# Altium schematic sheet Channel_B.SchDoc
size OrCAD E; SheetNumber: 6; SheetTotal: 6
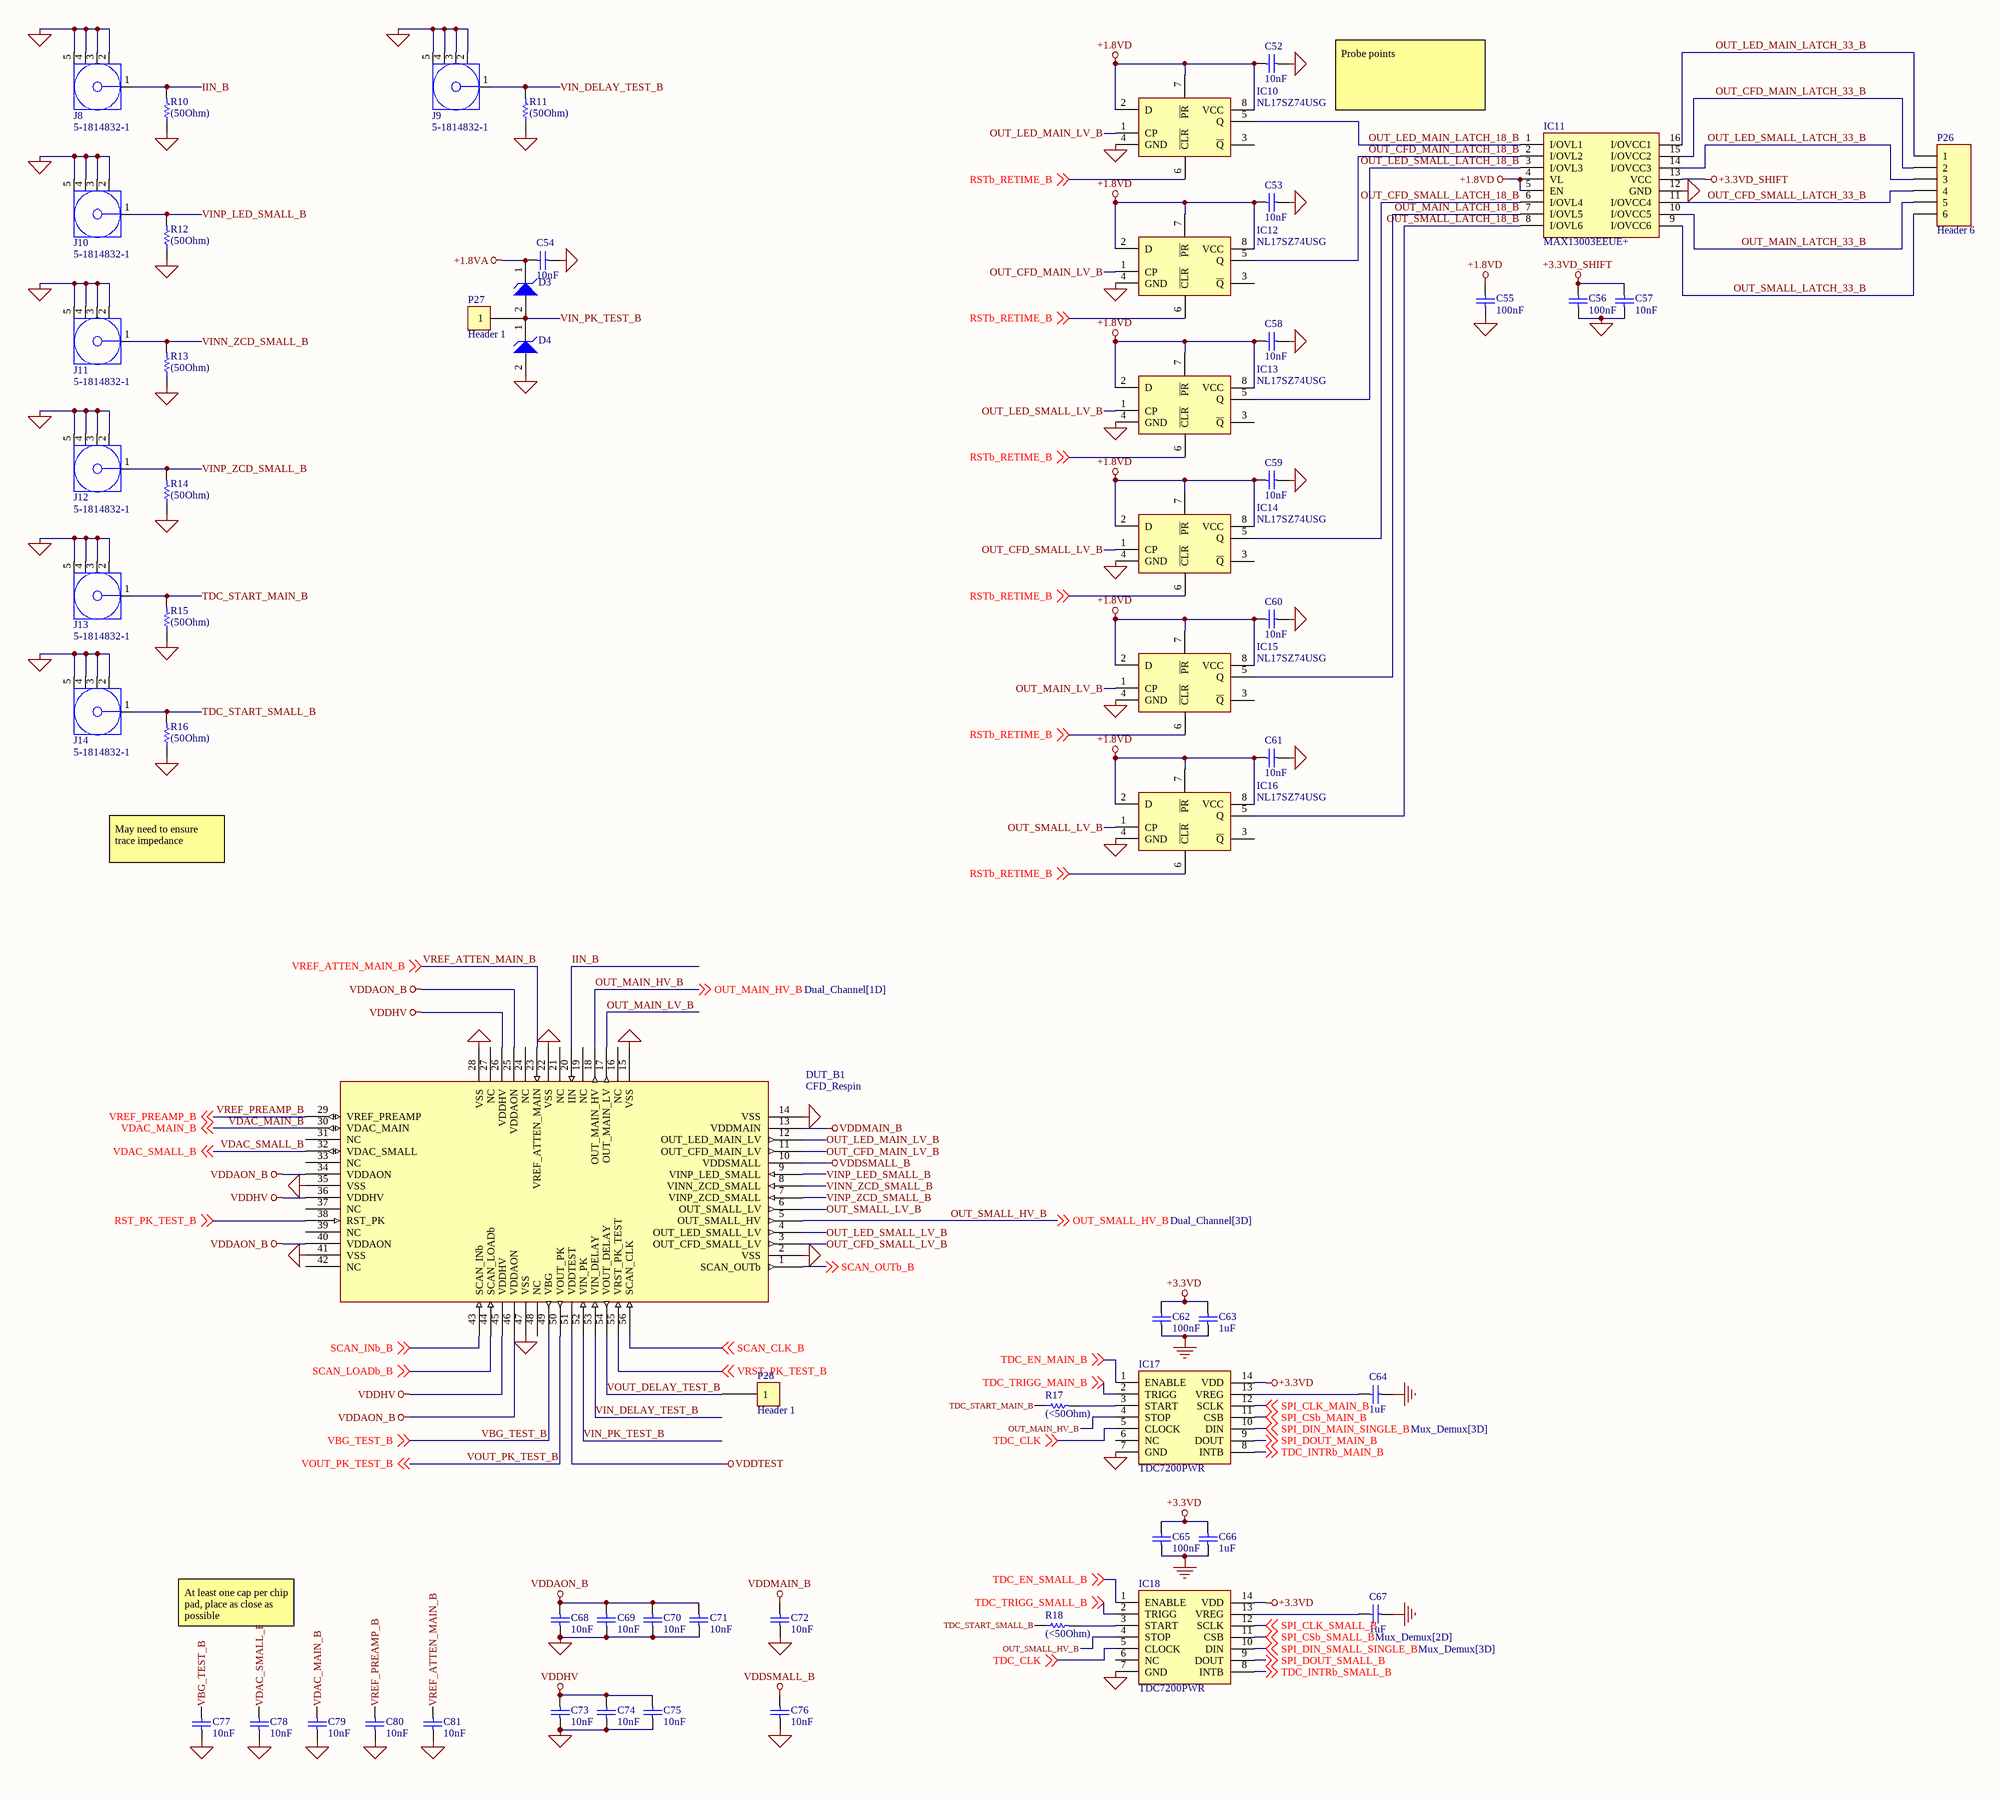
[diagram p0: Channel_B.SchDoc]

## Parts
C52  10nF  [CAPC1608X90X35ML10T15]
C53  10nF  [CAPC1608X90X35ML10T15]
C54  10nF  [CAPC1608X90X35ML10T15]
C55  100nF  [CAPC1608X90X35ML10T15]
C56  100nF  [CAPC1608X90X35ML10T15]
C57  10nF  [CAPC1608X90X35ML10T15]
C58  10nF  [CAPC1608X90X35ML10T15]
C59  10nF  [CAPC1608X90X35ML10T15]
C60  10nF  [CAPC1608X90X35ML10T15]
C61  10nF  [CAPC1608X90X35ML10T15]
C62  100nF  [CAPC1608X90X35ML10T15]
C63  1uF  [CAPC1608X90X35ML10T15]
C64  1uF  [CAPC1608X90X35ML10T15]
C65  100nF  [CAPC1608X90X35ML10T15]
C66  1uF  [CAPC1608X90X35ML10T15]
C67  1uF  [CAPC1608X90X35ML10T15]
C68  10nF  [CAPC1608X90X35ML10T15]
C69  10nF  [CAPC1608X90X35ML10T15]
C70  10nF  [CAPC1608X90X35ML10T15]
C71  10nF  [CAPC1608X90X35ML10T15]
C72  10nF  [CAPC1608X90X35ML10T15]
C73  10nF  [CAPC1608X90X35ML10T15]
C74  10nF  [CAPC1608X90X35ML10T15]
C75  10nF  [CAPC1608X90X35ML10T15]
C76  10nF  [CAPC1608X90X35ML10T15]
C77  10nF  [CAPC1608X90X35ML10T15]
C78  10nF  [CAPC1608X90X35ML10T15]
C79  10nF  [CAPC1608X90X35ML10T15]
C80  10nF  [CAPC1608X90X35ML10T15]
C81  10nF  [CAPC1608X90X35ML10T15]
D3  (no value)  [ONSC-SOD-123-2-425-04_V]
D4  (no value)  [ONSC-SOD-123-2-425-04_V]
DUT_B1  CFD_Respin  [QFN50P800X800X80_HS-57N_WIDEVIAS]
IC10  NL17SZ74USG  [SOP50P310X90-8N]
IC11  MAX13003EEUE+  [SOP65P640X110-16N]
IC12  NL17SZ74USG  [SOP50P310X90-8N]
IC13  NL17SZ74USG  [SOP50P310X90-8N]
IC14  NL17SZ74USG  [SOP50P310X90-8N]
IC15  NL17SZ74USG  [SOP50P310X90-8N]
IC16  NL17SZ74USG  [SOP50P310X90-8N]
IC17  TDC7200PWR  [SOP65P640X120-14N]
IC18  TDC7200PWR  [SOP65P640X120-14N]
J8  5-1814832-1  [TECO-5-1814832-1_V]
J9  5-1814832-1  [TECO-5-1814832-1_V]
J10  5-1814832-1  [TECO-5-1814832-1_V]
J11  5-1814832-1  [TECO-5-1814832-1_V]
J12  5-1814832-1  [TECO-5-1814832-1_V]
J13  5-1814832-1  [TECO-5-1814832-1_V]
J14  5-1814832-1  [TECO-5-1814832-1_V]
P26  Header 6  [HDR1X6]
P27  Header 1  [Header1]
P28  Header 1  [Header1]
R10  (50Ohm)  [RESC1609X50X30NL8T20]
R11  (50Ohm)  [RESC1609X50X30NL8T20]
R12  (50Ohm)  [RESC1609X50X30NL8T20]
R13  (50Ohm)  [RESC1609X50X30NL8T20]
R14  (50Ohm)  [RESC1609X50X30NL8T20]
R15  (50Ohm)  [RESC1609X50X30NL8T20]
R16  (50Ohm)  [RESC1609X50X30NL8T20]
R17  (<50Ohm)  [RESC1609X50X30NL8T20]
R18  (<50Ohm)  [RESC1609X50X30NL8T20]

## Nets
+1.8VA: C54.2 D3.1(K)
+1.8VD: C52.2 C53.2 C55.2 C58.2 C59.2 C60.2 C61.2 IC10.2(D) IC10.7(~{PR}) IC10.8(VCC) IC11.4(VL) IC11.5(EN) IC12.2(D) IC12.7(~{PR}) IC12.8(VCC) IC13.2(D) IC13.7(~{PR}) IC13.8(VCC) IC14.2(D) IC14.7(~{PR}) IC14.8(VCC) IC15.2(D) IC15.7(~{PR}) IC15.8(VCC) IC16.2(D) IC16.7(~{PR}) IC16.8(VCC)
+3.3VD: C62.1 C63.1 C65.1 C66.1 IC17.14(VDD) IC18.14(VDD)
+3.3VD_SHIFT: C56.2 C57.2 IC11.13(VCC)
GND: C52.1 C53.1 C54.1 C55.1 C56.1 C57.1 C58.1 C59.1 C60.1 C61.1 C62.2 C63.2 C64.2 C65.2 C66.2 C67.2 C68.1 C69.1 C70.1 C71.1 C72.1 C73.1 C74.1 C75.1 C76.1 C77.1 C78.1 C79.1 C80.1 C81.1 D4.2(A) DUT_B1.2(VSS) DUT_B1.14(VSS) DUT_B1.15(VSS) DUT_B1.22(VSS) DUT_B1.28(VSS) DUT_B1.35(VSS) DUT_B1.41(VSS) DUT_B1.47(VSS) IC10.4(GND) IC11.12(GND) IC12.4(GND) IC13.4(GND) IC14.4(GND) IC15.4(GND) IC16.4(GND) IC17.7(GND) IC18.7(GND) J8.2 J8.3 J8.4 J8.5 J9.2 J9.3 J9.4 J9.5 J10.2 J10.3 J10.4 J10.5 J11.2 J11.3 J11.4 J11.5 J12.2 J12.3 J12.4 J12.5 J13.2 J13.3 J13.4 J13.5 J14.2 J14.3 J14.4 J14.5 R10.1 R11.1 R12.1 R13.1 R14.1 R15.1 R16.1
VDDAON_B: C68.2 C69.2 C70.2 C71.2 DUT_B1.25(VDDAON) DUT_B1.34(VDDAON) DUT_B1.40(VDDAON) DUT_B1.46(VDDAON)
VDDHV: C73.2 C74.2 C75.2 DUT_B1.26(VDDHV) DUT_B1.36(VDDHV) DUT_B1.45(VDDHV)
VDDMAIN_B: C72.2 DUT_B1.13(VDDMAIN)
VDDSMALL_B: C76.2 DUT_B1.10(VDDSMALL)
VDDTEST: DUT_B1.51(VDDTEST)
IIN_B: DUT_B1.20(IIN) J8.1 R10.2
OUT_CFD_MAIN_LATCH_18_B: IC11.2(I/OVL2) IC12.5(Q)
OUT_CFD_MAIN_LATCH_33_B: IC11.15(I/OVCC2) P26.2
OUT_CFD_MAIN_LV_B: DUT_B1.11(OUT_CFD_MAIN_LV) IC12.1(CP)
OUT_CFD_SMALL_LATCH_18_B: IC11.6(I/OVL4) IC14.5(Q)
OUT_CFD_SMALL_LATCH_33_B: IC11.11(I/OVCC4) P26.4
OUT_CFD_SMALL_LV_B: DUT_B1.3(OUT_CFD_SMALL_LV) IC14.1(CP)
OUT_LED_MAIN_LATCH_18_B: IC10.5(Q) IC11.1(I/OVL1)
OUT_LED_MAIN_LATCH_33_B: IC11.16(I/OVCC1) P26.1
OUT_LED_MAIN_LV_B: DUT_B1.12(OUT_LED_MAIN_LV) IC10.1(CP)
OUT_LED_SMALL_LATCH_18_B: IC11.3(I/OVL3) IC13.5(Q)
OUT_LED_SMALL_LATCH_33_B: IC11.14(I/OVCC3) P26.3
OUT_LED_SMALL_LV_B: DUT_B1.4(OUT_LED_SMALL_LV) IC13.1(CP)
OUT_MAIN_HV_B: DUT_B1.18(OUT_MAIN_HV) IC17.4(STOP) ; off-sheet OUT_MAIN_HV_B
OUT_MAIN_LATCH_18_B: IC11.7(I/OVL5) IC15.5(Q)
OUT_MAIN_LATCH_33_B: IC11.10(I/OVCC5) P26.5
OUT_MAIN_LV_B: DUT_B1.17(OUT_MAIN_LV) IC15.1(CP)
OUT_SMALL_HV_B: DUT_B1.5(OUT_SMALL_HV) IC18.4(STOP) ; off-sheet OUT_SMALL_HV_B
OUT_SMALL_LATCH_18_B: IC11.8(I/OVL6) IC16.5(Q)
OUT_SMALL_LATCH_33_B: IC11.9(I/OVCC6) P26.6
OUT_SMALL_LV_B: DUT_B1.6(OUT_SMALL_LV) IC16.1(CP)
RST_PK_TEST_B: DUT_B1.38(RST_PK) ; off-sheet RST_PK_TEST_B
RSTb_RETIME_B: IC10.6(~{CLR}) IC12.6(~{CLR}) IC13.6(~{CLR}) IC14.6(~{CLR}) IC15.6(~{CLR}) IC16.6(~{CLR}) ; off-sheet RSTb_RETIME_B
SCAN_CLK_B: DUT_B1.56(SCAN_CLK) ; off-sheet SCAN_CLK_B
SCAN_INb_B: DUT_B1.43(SCAN_INb) ; off-sheet SCAN_INb_B
SCAN_LOADb_B: DUT_B1.44(SCAN_LOADb) ; off-sheet SCAN_LOADb_B
SCAN_OUTb_B: DUT_B1.1(SCAN_OUTb) ; off-sheet SCAN_OUTb_B
SPI_CLK_MAIN_B: IC17.12(SCLK) ; off-sheet SPI_CLK_MAIN_B
SPI_CLK_SMALL_B: IC18.12(SCLK) ; off-sheet SPI_CLK_SMALL_B
SPI_CSb_MAIN_B: IC17.11(CSB) ; off-sheet SPI_CSb_MAIN_B
SPI_CSb_SMALL_B: IC18.11(CSB) ; off-sheet SPI_CSb_SMALL_B
SPI_DIN_MAIN_SINGLE_B: IC17.10(DIN) ; off-sheet SPI_DIN_MAIN_SINGLE_B
SPI_DIN_SMALL_SINGLE_B: IC18.10(DIN) ; off-sheet SPI_DIN_SMALL_SINGLE_B
SPI_DOUT_MAIN_B: IC17.9(DOUT) ; off-sheet SPI_DOUT_MAIN_B
SPI_DOUT_SMALL_B: IC18.9(DOUT) ; off-sheet SPI_DOUT_SMALL_B
TDC_CLK: IC17.5(CLOCK) IC18.5(CLOCK) ; off-sheet TDC_CLK
TDC_EN_MAIN_B: IC17.1(ENABLE) ; off-sheet TDC_EN_MAIN_B
TDC_EN_SMALL_B: IC18.1(ENABLE) ; off-sheet TDC_EN_SMALL_B
TDC_INTRb_MAIN_B: IC17.8(INTB) ; off-sheet TDC_INTRb_MAIN_B
TDC_INTRb_SMALL_B: IC18.8(INTB) ; off-sheet TDC_INTRb_SMALL_B
TDC_START_MAIN_B: J13.1 R15.2 R17.1
TDC_START_SMALL_B: J14.1 R16.2 R18.1
TDC_TRIGG_MAIN_B: IC17.2(TRIGG) ; off-sheet TDC_TRIGG_MAIN_B
TDC_TRIGG_SMALL_B: IC18.2(TRIGG) ; off-sheet TDC_TRIGG_SMALL_B
VBG_TEST_B: C77.2 DUT_B1.49(VBG) ; off-sheet VBG_TEST_B
VDAC_MAIN_B: C79.2 DUT_B1.30(VDAC_MAIN) ; off-sheet VDAC_MAIN_B
VDAC_SMALL_B: C78.2 DUT_B1.32(VDAC_SMALL) ; off-sheet VDAC_SMALL_B
VIN_DELAY_TEST_B: DUT_B1.53(VIN_DELAY) J9.1 R11.2
VIN_PK_TEST_B: D3.2(A) D4.1(K) DUT_B1.52(VIN_PK) P27.1
VINN_ZCD_SMALL_B: DUT_B1.8(VINN_ZCD_SMALL) J11.1 R13.2
VINP_LED_SMALL_B: DUT_B1.9(VINP_LED_SMALL) J10.1 R12.2
VINP_ZCD_SMALL_B: DUT_B1.7(VINP_ZCD_SMALL) J12.1 R14.2
VOUT_DELAY_TEST_B: DUT_B1.54(VOUT_DELAY) P28.1
VOUT_PK_TEST_B: DUT_B1.50(VOUT_PK) ; off-sheet VOUT_PK_TEST_B
VREF_ATTEN_MAIN_B: C81.2 DUT_B1.23(VREF_ATTEN_MAIN) ; off-sheet VREF_ATTEN_MAIN_B
VREF_PREAMP_B: C80.2 DUT_B1.29(VREF_PREAMP) ; off-sheet VREF_PREAMP_B
VRST_PK_TEST_B: DUT_B1.55(VRST_PK_TEST) ; off-sheet VRST_PK_TEST_B
NetC64_1: C64.1 IC17.13(VREG)
NetC67_1: C67.1 IC18.13(VREG)
NetIC17_3: IC17.3(START) R17.2
NetIC18_3: IC18.3(START) R18.2

Not connected (* = marked no-connect by the designer): DUT_B1 16(NC) 19(NC) 21(NC) 24(NC) 27(NC) 31(NC) 33(NC) 37(NC) 39(NC) 42(NC) 48(NC); IC10 3(~{Q}); IC12 3(~{Q}); IC13 3(~{Q}); IC14 3(~{Q}); IC15 3(~{Q}); IC16 3(~{Q}); IC17 6(NC); IC18 6(NC)

## Notes on the sheet
- Probe points
- May need to ensure trace impedance
- At least one cap per chip pad, place as close as possible

## Library data of the parts
C52-C81 = CMP-2000-04945-1: 0603; Manufacturer: Murata; Capacitance: 22pF; Tolerance (%): ±5%; Rated Voltage: 50V; Dielectric: C0G; Manufacturer URL: http://www.murata.com/; Datasheet Version: Jul-06; Package Reference: 603; Case Size/Dimension: 0603; Package Description: 2-Pin Surface Mount Device, Body 1.6 x 0.8 mm; Datasheet URL: https://datasheet.ciiva.com/11786/0900766b807a1cab-11786398.pdf
D3 D4 = CMP-1060-00509-1: Zener Voltage Regulator, 2-Pin SOD-123, Pb-Free, Tape and Reel; Manufacturer: On Semiconductor; PartNumber: MMSZ4679T1G; P Max (W): 0.5; VZ Typ (V): 2; Packing: Tape and Reel; ComponentLink1Description: Manufacturer URL; DatasheetVersion: Rev. 9; PackageReference: SOD-123-2-425-04; ComponentLink3URL: http://www.onsemi.com/pub_link/Collateral/425-04.PDF; PackageDescription: 2-Pin SOD, Body 1.6 x 2.69 mm; ComponentLink3Description: Package Specification; ComponentLink2Description: Datasheet; ComponentLink1URL: http://www.onsemi.com/; RoHS: Pb-Free; PackageVersion: Rev. G, 10/2009; ComponentLink2URL: http://www.onsemi.com/pub_link/Collateral/MMSZ4678T1-D.PDF; Mounting Technology: Surface Mount
IC10 IC12-IC16 = NL17SZ74USG: Flip Flops 1.65-5.5V CMOS Single D-Type; Manufacturer_Name: ON Semiconductor; Datasheet Link: http://www.onsemi.com/pub/Collateral/NL17SZ74-D.PDF; Height: 0.9mm; Manufacturer_Part_Number: NL17SZ74USG
IC11 = MAX13003EEUE+: Integrated Circuit; Manufacturer_Name: Maxim Integrated; Datasheet Link: https://pdfserv.maximintegrated.com/en/ds/MAX13000E-MAX13005E.pdf; Height: 1.1mm; Manufacturer_Part_Number: MAX13003EEUE+
IC17 IC18 = TDC7200PWR: Integrated Circuit; Manufacturer_Name: Texas Instruments; Datasheet Link: http://www.ti.com/lit/gpn/tdc7200; Height: 1.2mm; Manufacturer_Part_Number: TDC7200PWR
J8-J14 = CMP-2000-05415-1: SMA Connector, Pitch 5.08 mm, 1 Position, Height 9.5 mm, Tail Length 4 mm, -65 to 165 degC, RoHS, Bulk; Manufacturer: TE Connectivity; Connector Mounting: PCBMount; Connector Body Style: StraightJack; Impedance: 50ohm; Coaxial Termination: Solder; SVHC: NoSVHC(15-Jun-2015); Frequency Max: 3GHz; Product Range: ZDCSeries; Connector Type: SMACoaxial; Datasheet Version: Rev. B1, 03/2011; Package Reference: 5-1814832-1; Package Description: SMA Connector, Pitch 5.08 mm, 1 Position, Height 9.5 mm, Tail Length 4 mm; Contact Plating: GoldPlatedContacts; Coaxial Cable Types: -; Contact Material: BerylliumCopper; Manufacturer URL: http://www.te.com/; Datasheet URL: http://www.onlinecomponents.com/productFiles/mf-AMP/eng_cd_1814832_a.pdf
P26 = Header 6: Header, 6-Pin; LatestRevisionDate: 17-Jul-2002; LatestRevisionNote: Re-released for DXP Platform.; Publisher: Altium Limited
R10-R18 = CMP-2000-03816-5: 0603; Manufacturer: Vishay Semiconductor; Voltage Rating: 75 V; Package Quantity: 5000; DatasheetVersion: 06/2012; Min Operating Temperature: -55 degC; ComponentLink1URL: http://www.vishay.com/; Mounting Technology: Surface Mount; Height: 0.45 mm; ComponentLink1Description: Manufacturer URL; REACH SVHC: Unknown; PackageReference: 0603; Packaging: Tape and Reel; Max Operating Temperature: 155 degC; Mount: Surface Mount; ComponentLink2Description: Datasheet; PackageDescription: 2-Pin Surface Mount Device, Body 1.575 x 0.85 mm; Length: 1.55 mm; ComponentLink2URL: http://www.vishay.com/docs/20035/dcrcwe3.pdf; Pins: 2; RoHSCompliant: true